# Altium schematic sheet Sheet1.SchDoc
size A4
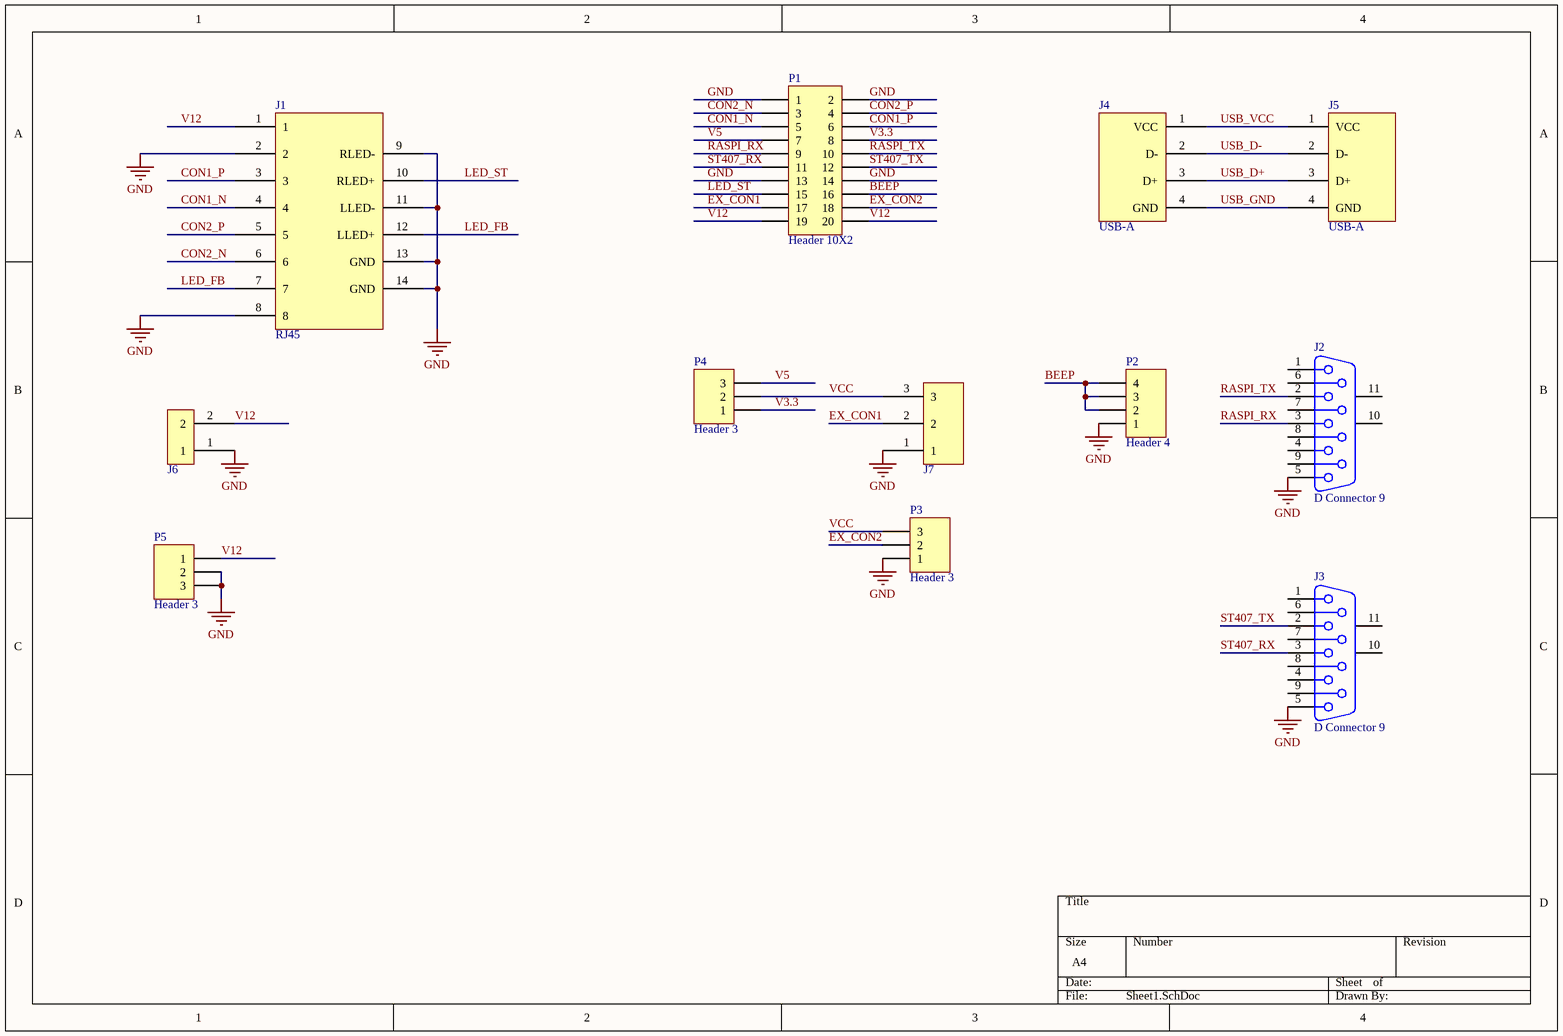
[diagram p0: Sheet1.SchDoc]

## Parts
J1  RJ45  [RJ45_1]
J2  D Connector 9  [DSUB1.385-2H9]
J3  D Connector 9  [DSUB1.385-2H9]
J4  USB-A  [USB-A]
J5  USB-A  [USB-A]
J6  XK7.62-2P  [XK7.62-2P]  (value not drawn)
J7  KF301-3P  [KF301-3P]  (value not drawn)
P1  Header 10X2  [HDR2X10]
P2  Header 4  [HDR1X4]
P3  Header 3  [HDR1X3]
P4  Header 3  [HDR1X3]
P5  Header 3  [DC005]

## Nets
GND: J1.2 J1.8 J1.9(RLED-) J1.11(LLED-) J1.13(GND) J1.14(GND) J2.5 J3.5 J6.1 J7.1 P1.1 P1.2 P1.13 P1.14 P2.1 P3.1 P5.2 P5.3
BEEP: P1.16 P2.2 P2.3 P2.4
CON1_N: J1.4 P1.5
CON1_P: J1.3 P1.6
CON2_N: J1.6 P1.3
CON2_P: J1.5 P1.4
EX_CON1: J7.2 P1.17
EX_CON2: P1.18 P3.2
LED_FB: J1.7 J1.12(LLED+)
LED_ST: J1.10(RLED+) P1.15
RASPI_RX: J2.3 P1.9
RASPI_TX: J2.2 P1.10
ST407_RX: J3.3 P1.11
ST407_TX: J3.2 P1.12
USB_D+: J4.3(D+) J5.3(D+)
USB_D-: J4.2(D-) J5.2(D-)
USB_GND: J4.4(GND) J5.4(GND)
USB_VCC: J4.1(VCC) J5.1(VCC)
V3.3: P1.8 P4.1
V5: P1.7 P4.3
V12: J1.1 J6.2 P1.19 P1.20 P5.1
VCC: J7.3 P3.3 P4.2

Not connected (* = marked no-connect by the designer): J2 1 4 6 7 8 9 10(MH1) 11(MH2); J3 1 4 6 7 8 9 10(MH1) 11(MH2)

## Library data of the parts
J1 = RJ45_1
J2 J3 = D Connector 9: Receptacle Assembly, 9 Position, Right Angle; PackageDocument: O; Positions: 9; Published: 15-Jun-2001; LatestRevisionDate: 17-Jul-2002; LatestRevisionNote: Re-released for DXP Platform.; DatasheetDocument: 1-Sep-1999; PackageReference: 788750; Publisher: Altium Limited; Orientation: Right Angle; Gender: Receptacle
J4 J5 = USB-A: USB-A female
P1 = Header 10X2: Header, 10-Pin, Dual row; LatestRevisionDate: 17-Jul-2002; LatestRevisionNote: Re-released for DXP Platform.; Publisher: Altium Limited
P2 = Header 4: Header, 4-Pin; LatestRevisionDate: 17-Jul-2002; LatestRevisionNote: Re-released for DXP Platform.; Publisher: Altium Limited
P3-P5 = Header 3: Header, 3-Pin; LatestRevisionDate: 17-Jul-2002; LatestRevisionNote: Re-released for DXP Platform.; Publisher: Altium Limited